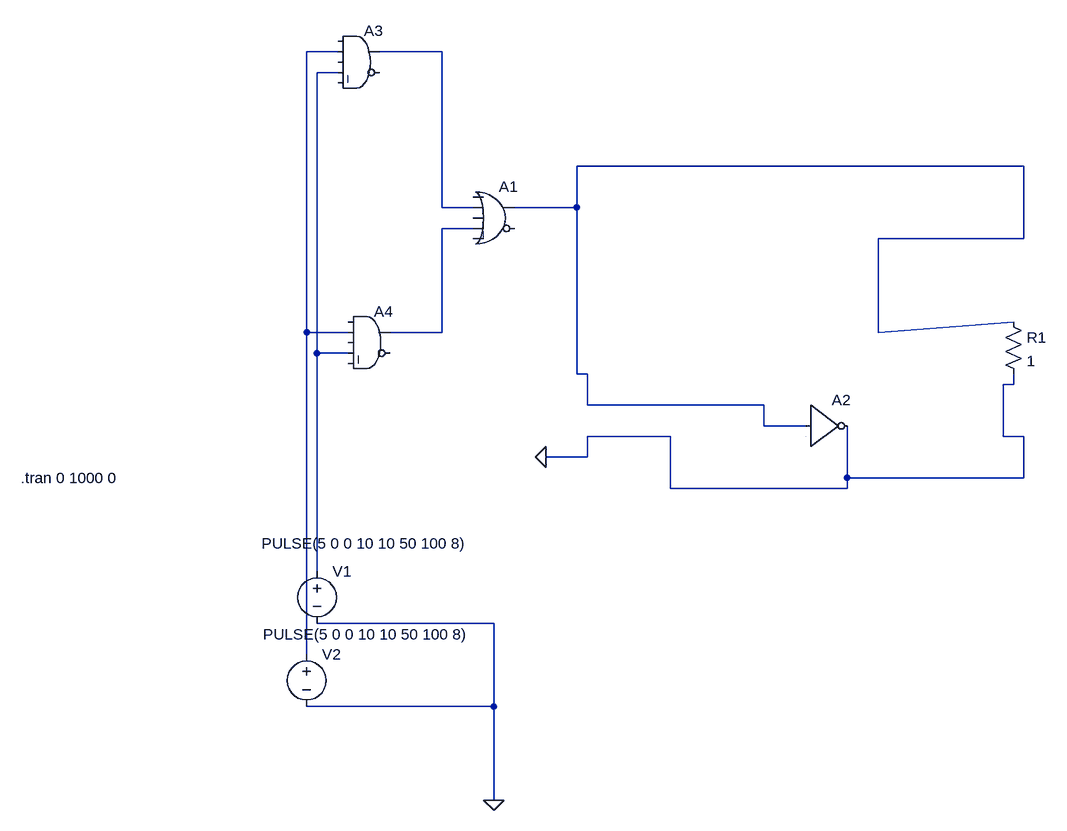
[diagram p0: schematic AOI22.asc]
AOI22.asc, the LTspice schematic file:
Version 4
SHEET 1 1048 788
WIRE -48 -384 -96 -384
WIRE 112 -384 16 -384
WIRE -48 -352 -80 -352
WIRE 1008 -208 320 -208
WIRE 112 -144 112 -384
WIRE 160 -144 112 -144
WIRE 320 -144 320 -208
WIRE 320 -144 224 -144
WIRE 160 -112 112 -112
WIRE 1008 -96 1008 -208
WIRE 1008 -96 784 -96
WIRE -96 48 -96 -384
WIRE -32 48 -96 48
WIRE 112 48 112 -112
WIRE 112 48 32 48
WIRE 784 48 784 -96
WIRE 784 48 992 32
WIRE -80 80 -80 -352
WIRE -32 80 -80 80
WIRE 320 112 320 -144
WIRE 336 112 320 112
WIRE 992 128 992 112
WIRE 992 128 976 128
WIRE 336 160 336 112
WIRE 608 160 336 160
WIRE 608 192 608 160
WIRE 672 192 608 192
WIRE 464 208 336 208
WIRE 976 208 976 128
WIRE 1008 208 976 208
WIRE 336 240 336 208
WIRE 336 240 272 240
WIRE 736 272 736 192
WIRE 1008 272 1008 208
WIRE 1008 272 736 272
WIRE 464 288 464 208
WIRE 736 288 736 272
WIRE 736 288 464 288
WIRE -80 416 -80 80
WIRE 192 496 -80 496
WIRE -96 544 -96 48
WIRE 192 624 192 496
WIRE 192 624 -96 624
WIRE 192 768 192 624
FLAG 272 240 0
FLAG 192 768 0
SYMBOL voltage -80 400 R0
WINDOW 3 -85 -27 Left 2
WINDOW 123 0 0 Left 0
WINDOW 39 0 0 Left 0
SYMATTR InstName V1
SYMATTR Value PULSE(5 0 0 10 10 50 100 8)
SYMBOL voltage -96 528 R0
WINDOW 3 -67 -15 Left 2
WINDOW 123 0 0 Left 0
WINDOW 39 0 0 Left 0
SYMATTR InstName V2
SYMATTR Value PULSE(5 0 0 10 10 50 100 8)
SYMBOL Digital\\inv 672 128 R0
SYMATTR InstName A2
SYMBOL res 976 16 R0
SYMATTR InstName R1
SYMATTR Value 1
SYMBOL Digital\\or 192 -192 R0
SYMATTR InstName A1
SYMBOL Digital\\and -16 -432 R0
SYMATTR InstName A3
SYMBOL Digital\\and 0 0 R0
SYMATTR InstName A4
TEXT -536 272 Left 2 !.tran 0 1000 0

The netlist it stands for:
* AOI22.asc
V1 N003 0 PULSE(5 0 0 10 10 50 100 8)
V2 N001 0 PULSE(5 0 0 10 10 50 100 8)
A2 N004 0 0 0 0 0 0 0 BUF
R1 N004 0 1
A1 0 N002 0 N005 0 0 N004 0 OR
A3 0 N001 0 N003 0 0 N002 0 AND
A4 0 N001 0 N003 0 0 N005 0 AND
.tran 0 1000 0
.backanno
.end